# EAGLE schematic guitar tuner amplifier (EAGLE 6.5.0)
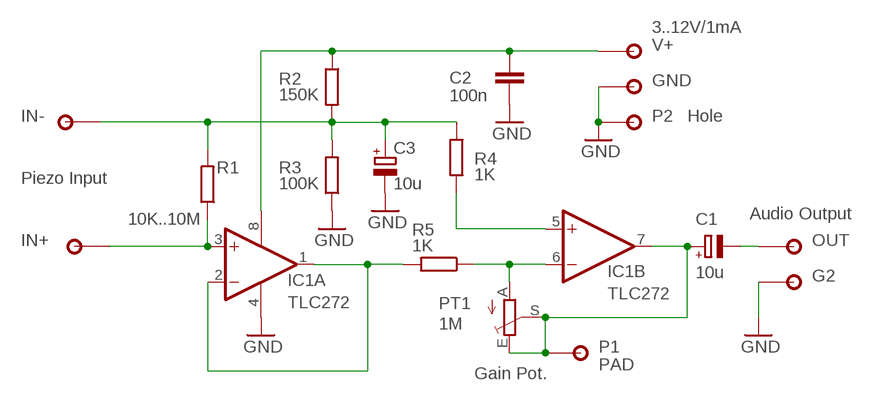
[diagram p0: schematic, sheet 1]

## Parts
C1  10u  CPOL-EUE2.5-5  [E2,5-5]
C2  100n  C-EU025-025X050  [C025-025X050]
C3  10u  CPOL-EUE2.5-5  [E2,5-5]
G2  PAD1,46MM  [PAD146]
GND  PAD1,46MM  [PAD146]
IC1  TLC272  TLC272P  [DIL08]
IN+  PAD1,46MM  [PAD146]
IN-  PAD1,46MM  [PAD146]
OUT  PAD1,46MM  [PAD146]
P1  PAD  PADL2  [PAD127L1]
P2  Hole  PAD1,46MM  [PAD146]
PT1  1M  TRIM_EU-CA6V  [CA6V]
R1  10K..10M  R-EU_0207/10  [0207/10]
R2  150K  R-EU_0207/10  [0207/10]
R3  100K  R-EU_0207/10  [0207/10]
R4  1K  R-EU_0207/10  [0207/10]
R5  1K  R-EU_0207/10  [0207/10]
V+  PAD1,46MM  [PAD146]

## Nets
GND: C2.1 C3.- G2.1 GND.1 IC1.4(P:V-) P2.1 R3.1
N$2: IC1.6(B:-IN) PT1.A R5.1
N$3: C1.- OUT.1
N$5: IC1.5(B:+IN) R4.1
N$6: C1.+ IC1.7(B:OUT) P1.P$2 PT1.E PT1.S
N$14: IC1.1(A:OUT) IC1.2(A:-IN) R5.2
N$15: IC1.3(A:+IN) IN+.1 R1.1
N$20: C3.+ IN-.1 R1.2 R2.2 R3.2 R4.2
V9V: C2.2 IC1.8(P:V+) R2.1 V+.1

## Notes on the sheet
- 3..12V/1mA
- Piezo Input
- Audio Output
- Gain Pot.

## Library data of the parts
C1 C3 = rcl:CPOL-EU: POLARIZED CAPACITOR, European symbol
C2 = rcl:C-EU: CAPACITOR, European symbol
G2 GND IN+ IN- OUT P1 P2 V+ = 2martin:PAD
IC1 = linear:TLC272: OP AMP
PT1 = pot:TRIM_EU-: POTENTIOMETER
R1-R5 = rcl:R-EU_: RESISTOR, European symbol